# Altium project PlantSensor_V02.PrjPcb
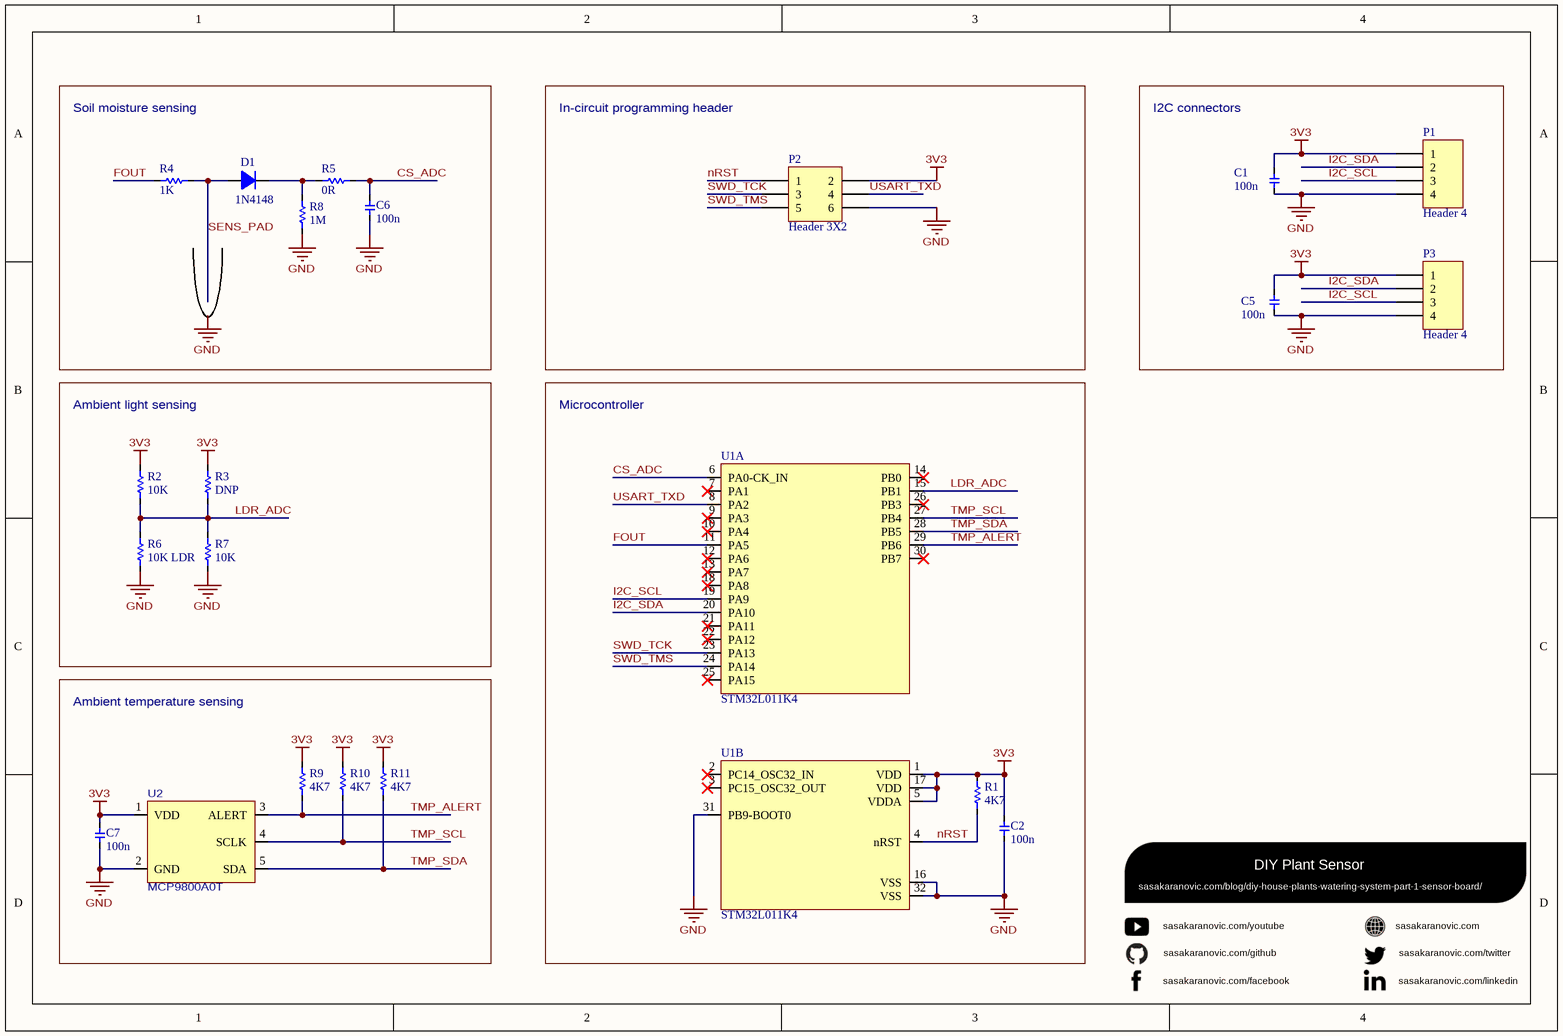
[diagram p0: PlantSensor_V02_Schematic.SchDoc]
1 sheet, 22 parts. Net scope: global (net labels, ports and power ports of the same name join across sheets).
Board file: PlantSensor_V02_PCB.PcbDoc

## Sheet PlantSensor_V02_Schematic.SchDoc: DIY Plant Sensor
size A4; URL: sasakaranovic.com/blog/diy-house-plants-watering-system-part-1-sensor-board/; Distributor: DigiKey

### Parts
C1  value 100n  [0603 - CAP]  (hidden comment: Cap)
C2  value 100n  [0603 - CAP]  (hidden comment: Cap)
C5  value 100n  [0603 - CAP]  (hidden comment: Cap)
C6  value 100n  [0603 - CAP]  (hidden comment: Cap)
C7  value 100n  [0603 - CAP]  (hidden comment: Cap)
D1  1N4148  [SOD123]
P1  Header 4  [Header 4x1]
P2  Header 3X2  [HDR2X3]
P3  Header 4  [Header 4x1]
R1  value 4K7  [0603]  (hidden comment: Res)
R2  value 10K  [0603]  (hidden comment: Res)
R3  value DNP  [0603]  (hidden comment: Res)  (no BOM)
R4  value 1K  [0603]  (hidden comment: Res)
R5  value 0R  [0603]  (hidden comment: Res)
R6  value 10K LDR  [Radial0.1 - SMT]  (hidden comment: Res)
R7  value 10K  [0603]  (hidden comment: Res)
R8  value 1M  [0603]  (hidden comment: Res)
R9  value 4K7  [0603]  (hidden comment: Res)
R10  value 4K7  [0603]  (hidden comment: Res)
R11  value 4K7  [0603]  (hidden comment: Res)
U1  STM32L011K4  [TQFP80P900X900X160-32N]  (parts A,B of 2)
U2  MCP9800A0T  [SOT95P270X145-5N]

### Blocks framed on the sheet
Soil moisture sensing: C6 D1 R4 R5 R8
In-circuit programming header: P2
I2C connectors: C1 C5 P1 P3
Ambient light sensing: R2 R3 R6 R7
Microcontroller: C2 R1 U1
Ambient temperature sensing: C7 R9-R11 U2

### Nets
3V3: C1.2 C2.2 C5.2 C7.2 P1.1 P2.2 P3.1 R1.2 R2.2 R3.2 R9.2 R10.2 R11.2 U1.1(VDD) U1.5(VDDA) U1.17(VDD) U2.1(VDD)
GND: C1.1 C2.1 C5.1 C6.1 C7.1 P1.4 P2.6 P3.4 R6.1 R7.1 R8.1 U1.16(VSS) U1.31(PB9-BOOT0) U1.32(VSS) U2.2(GND)
CS_ADC: C6.2 R5.2 U1.6(PA0-CK_IN)
FOUT: R4.1 U1.11(PA5)
I2C_SCL: P1.3 P3.3 U1.19(PA9)
I2C_SDA: P1.2 P3.2 U1.20(PA10)
LDR_ADC: R2.1 R3.1 R6.2 R7.2 U1.15(PB1)
nRST: P2.1 R1.1 U1.4(nRST)
SENS_PAD: D1.A R4.2
SWD_TCK: P2.3 U1.23(PA13)
SWD_TMS: P2.5 U1.24(PA14)
TMP_ALERT: R9.1 U1.29(PB6) U2.3(ALERT)
TMP_SCL: R10.1 U1.27(PB4) U2.4(SCLK)
TMP_SDA: R11.1 U1.28(PB5) U2.5(SDA)
USART_TXD: P2.4 U1.8(PA2)
NetD1_K: D1.K R5.1 R8.2

Not connected (* = marked no-connect by the designer): U1 2(PC14_OSC32_IN)* 3(PC15_OSC32_OUT)* 7(PA1)* 9(PA3)* 10(PA4)* 12(PA6)* 13(PA7)* 14(PB0)* 18(PA8)* 21(PA11)* 22(PA12)* 25(PA15)* 26(PB3)* 30(PB7)*

### Notes on the sheet
- Labels drawn without touching a wire or pin: GND
- sasakaranovic.com/youtube
- sasakaranovic.com
- sasakaranovic.com/github
- sasakaranovic.com/facebook
- sasakaranovic.com/twitter
- sasakaranovic.com/linkedin

### Library data of the parts
C1 C2 C5-C7 = Cap: CAP CER 0.1UF 50V X7R 0603; Manufacturer: Samsung Electro-Mechanics; Manufacturer Part Number: CL10B104KB8NNNL; Distributor Part Number: 1276-CL10B104KB8NNNLCT-ND; Distributor: DigiKey
D1 = Diode: DIODE GEN PURP 100V 300MA SOD123; Manufacturer: Diodes Incorporated; Manufacturer Part Number: 1N4148W-7-F; Distributor: DigiKey; Distributor Part Number: 1N4148W-FDICT-ND
P1 P3 = Header 4: CONN HEADER VERT 4POS 2.54MM; Manufacturer: Würth Elektronik; Manufacturer Part Number: 61300411121; Distributor: DigiKey; Distributor Part Number: 732-5317-ND
P2 = Header 3X2: CONN HEADER VERT 6POS 2.54MM; Manufacturer: Adam Tech; Manufacturer Part Number: PH2-06-UA; Distributor: DigiKey; Distributor Part Number: 2057-PH2-06-UA-ND
R1 R9-R11 = Res: RES SMD 4.7K OHM 1% 1/10W 0603; Manufacturer: Yageo; Manufacturer Part Number: RC0603FR-074K7L; Distributor: DigiKey; Distributor Part Number: 311-4.70KHRCT-ND
R2 R7 = Res: RES SMD 10K OHM 1% 1/10W 0603; Manufacturer: Yageo; Manufacturer Part Number: AC0603FR-0710KL; Distributor: DigiKey; Distributor Part Number: 311-10KLDCT-ND
R3 = Res: Resistor; Distributor: DigiKey
R4 = Res: RES SMD 1K OHM 1% 1/10W 0603; Manufacturer: Yageo; Manufacturer Part Number: RT0603FRE071KL; Distributor: DigiKey; Distributor Part Number: YAG2323CT-ND
R5 = Res: RES SMD 0 OHM JUMPER 1/10W 0603; Manufacturer: Yageo; Manufacturer Part Number: AC0603JR-070RL; Distributor: DigiKey; Distributor Part Number: 311-0.0LECT-ND
R6 = Res: PHOTOCELL CDS 400OHM TO-18; Manufacturer: Advanced Photonix; Distributor: DigiKey; Distributor Part Number: NSL-5152-ND; Manufacturer Part Number: NSL-5152
R8 = Res: RES SMD 1M OHM 5% 1/10W 0603; Manufacturer: Yageo; Manufacturer Part Number: RC0603JR-071ML; Distributor: DigiKey; Distributor Part Number: 311-1.0MGRCT-ND
U1 = STM32L011K4: IC MCU 32BIT 16KB FLASH 32LQFP; Manufacturer: STMicroelectronics; Manufacturer Part Number: STM32L011K4T6; Distributor: DigiKey; Distributor Part Number: 497-17480-ND
U2 = MCP9800A0T-M/OT: SENSOR DIGITAL -55C-125C SOT23-5; Manufacturer: Microchip Technology; Distributor: DigiKey; Distributor Part Number: MCP9800A0T-M/OTCT-ND; Manufacturer Part Number: MCP9800A0T-M/OT